# Altium schematic sheet MR26_GSS_7.SchDoc
size 386 x 296 mm; Origin: Eagle; OriginPath: C:\Users\David Nguyen\Downloads\eagle\eagle\MR26_GSS.sch; OriginSheet: 8; OriginDescription: 09 Interfaces: vehicle, CAN, USB-C, debug
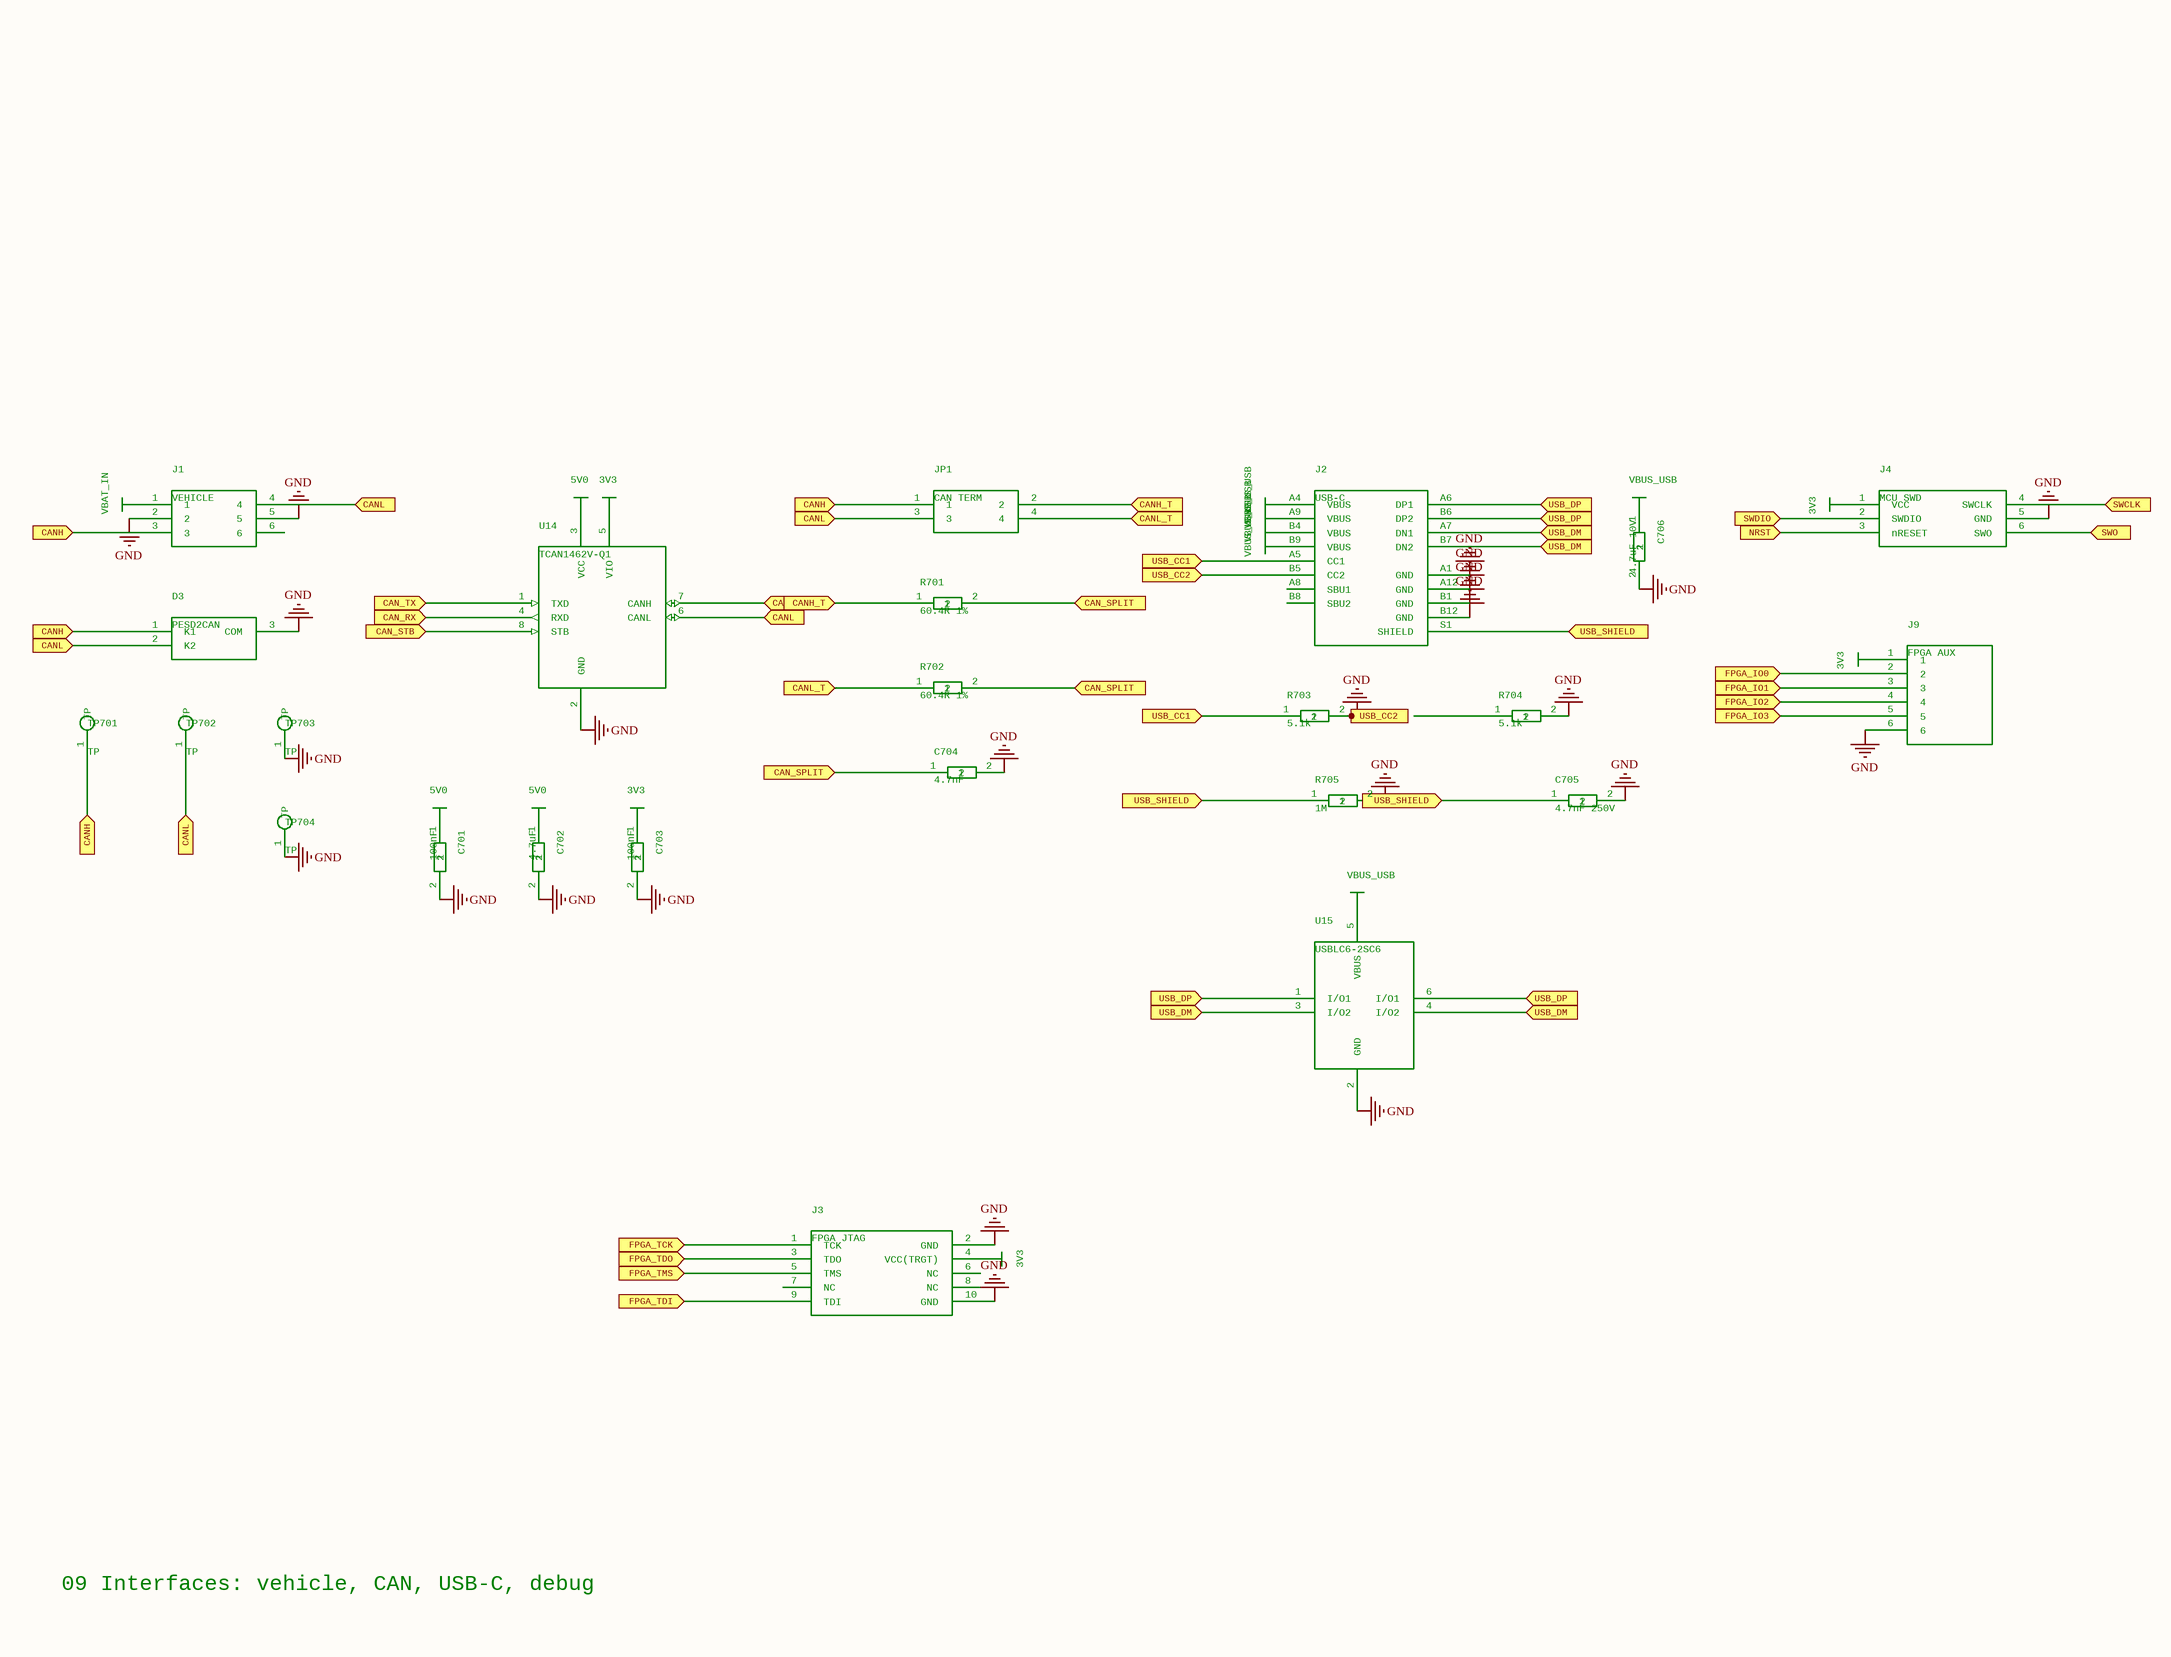
[diagram p0: MR26_GSS_7.SchDoc]

## Parts
C701  100nF  [C_0402]
C702  4.7uF  [C_0603]
C703  100nF  [C_0402]
C704  4.7nF  [C_0603]
C705  4.7nF 250V  [C_1206]
C706  4.7uF 10V  [C_0603]
D3  PESD2CAN  [SOT-23]
J1  VEHICLE  [Molex_Micro-Fit_43045-0600_2x3_RA]
J2  USB-C  [USB_C_GCT_USB4105]
J3  FPGA JTAG  [IDC-Header_2x05_P2.54mm]
J4  MCU SWD  [TC2030-IDC-NL]
J9  FPGA AUX  [PinHeader_1x06_P2.54mm]
JP1  CAN TERM  [PinHeader_2x02_P2.54mm]
PWR0571  VBAT_IN
PWR0577  5V0
PWR0578  3V3
PWR0580  5V0
PWR0582  5V0
PWR0584  3V3
PWR0587  VBUS_USB
PWR0588  VBUS_USB
PWR0589  VBUS_USB
PWR0590  VBUS_USB
PWR0599  VBUS_USB
PWR0601  VBUS_USB
PWR0604  3V3
PWR0606  3V3
PWR0608  3V3
R701  60.4R 1%  [R_0805]
R702  60.4R 1%  [R_0805]
R703  5.1k  [R_0402]
R704  5.1k  [R_0402]
R705  1M  [R_0402]
TP701  TP  [TP_1.0mm]
TP702  TP  [TP_1.0mm]
TP703  TP  [TP_1.0mm]
TP704  TP  [TP_1.0mm]
U14  TCAN1462V-Q1  [SOIC-8]
U15  USBLC6-2SC6  [SOT-23-6]

## Ports
CAN_RX (in), CAN_SPLIT (in), CAN_STB (in), CAN_TX (in), CANH (in), CANH_T (in), CANL (in), CANL_T (in), FPGA_IO0 (in), FPGA_IO1 (in), FPGA_IO2 (in), FPGA_IO3 (in), FPGA_TCK (in), FPGA_TDI (in), FPGA_TDO (in), FPGA_TMS (in), NRST (in), SWCLK (in), SWDIO (in), SWO (in), USB_CC1 (in), USB_CC2 (in), USB_DM (in), USB_DP (in), USB_SHIELD (in)

## Nets
GND: C701.2 C702.2 C703.2 C704.2 C705.2 C706.2 D3.3(COM) J1.2 J1.5 J2.A1(GND) J2.A12(GND) J2.B1(GND) J2.B5(CC2) J2.B12(GND) J3.2(GND) J3.10(GND) J4.5(GND) J9.6 R703.2 R704.2 R705.2 TP703.1(TP) TP704.1(TP) U14.2(GND) U15.2(GND) ; port USB_CC2
CAN_RX: U14.4(RXD) ; port CAN_RX
CAN_SPLIT: C704.1 R701.2 R702.2 ; port CAN_SPLIT
CAN_STB: U14.8(STB) ; port CAN_STB
CAN_TX: U14.1(TXD) ; port CAN_TX
CANH: D3.1(K1) J1.3 JP1.1 TP701.1(TP) U14.7(CANH) ; port CANH
CANH_T: JP1.2 R701.1 ; port CANH_T
CANL: D3.2(K2) J1.4 JP1.3 TP702.1(TP) U14.6(CANL) ; port CANL
CANL_T: JP1.4 R702.1 ; port CANL_T
FPGA_IO0: J9.2 ; port FPGA_IO0
FPGA_IO1: J9.3 ; port FPGA_IO1
FPGA_IO2: J9.4 ; port FPGA_IO2
FPGA_IO3: J9.5 ; port FPGA_IO3
FPGA_TCK: J3.1(TCK) ; port FPGA_TCK
FPGA_TDI: J3.9(TDI) ; port FPGA_TDI
FPGA_TDO: J3.3(TDO) ; port FPGA_TDO
FPGA_TMS: J3.5(TMS) ; port FPGA_TMS
NRST: J4.3(nRESET) ; port NRST
SWCLK: J4.4(SWCLK) ; port SWCLK
SWDIO: J4.2(SWDIO) ; port SWDIO
SWO: J4.6(SWO) ; port SWO
USB_CC1: J2.A5(CC1) R703.1 ; port USB_CC1
USB_DM: J2.A7(DN1) J2.B7(DN2) U15.3(I/O2) U15.4(I/O2) ; port USB_DM
USB_DP: J2.A6(DP1) J2.B6(DP2) U15.1(I/O1) U15.6(I/O1) ; port USB_DP
USB_SHIELD: C705.1 J2.S1(SHIELD) R705.1 ; port USB_SHIELD
NetC701_1: C701.1 PWR0580.?1(5V0)
NetC702_1: C702.1 PWR0582.?1(5V0)
NetC703_1: C703.1 PWR0584.?1(3V3)
NetC706_1: C706.1 PWR0599.?1(VBUS_USB)
NetJ1_1: J1.1 PWR0571.?1(VBAT_IN)
NetJ2_A4: J2.A4(VBUS) PWR0587.?1(VBUS_USB)
NetJ2_A9: J2.A9(VBUS) PWR0588.?1(VBUS_USB)
NetJ2_B4: J2.B4(VBUS) PWR0589.?1(VBUS_USB)
NetJ2_B9: J2.B9(VBUS) PWR0590.?1(VBUS_USB)
NetJ3_4: J3.4(VCC(TRGT)) PWR0604.?1(3V3)
NetJ4_1: J4.1(VCC) PWR0606.?1(3V3)
NetJ9_1: J9.1 PWR0608.?1(3V3)
NetPWR0577_?1: PWR0577.?1(5V0) U14.3(VCC)
NetPWR0578_?1: PWR0578.?1(3V3) U14.5(VIO)
NetPWR0601_?1: PWR0601.?1(VBUS_USB) U15.5(VBUS)

Not connected (* = marked no-connect by the designer): J1 6; J2 A8(SBU1) B8(SBU2); J3 6(NC) 7(NC) 8(NC); R704 1

## Notes on the sheet
- 09 Interfaces: vehicle, CAN, USB-C, debug

## Library data of the parts
C701 C703 = CAPC_0402: MPN: CAP 100nF 0402; GateName_1: G$1; SymbolName_1: CAP; DeviceName: C_0402; LibraryName: MR26; DeviceSetName: CAP
C702 = CAPC_0603: MPN: CAP 4.7uF 0603; GateName_1: G$1; SymbolName_1: CAP; DeviceName: C_0603; LibraryName: MR26; DeviceSetName: CAP
C704 = CAPC_0603: MPN: CAP 4.7nF 0603; GateName_1: G$1; SymbolName_1: CAP; DeviceName: C_0603; LibraryName: MR26; DeviceSetName: CAP
C705 = CAPC_1206: MPN: CAP 4.7nF 250V 1206; GateName_1: G$1; SymbolName_1: CAP; DeviceName: C_1206; LibraryName: MR26; DeviceSetName: CAP
C706 = CAPC_0603: MPN: CAP 4.7uF 10V 0603; GateName_1: G$1; SymbolName_1: CAP; DeviceName: C_0603; LibraryName: MR26; DeviceSetName: CAP
D3 = PESD2CAN_SOT23SOT-23: MPN: PESD2CAN,215; GateName_1: G$1; SymbolName_1: PESD2CAN_SOT23; DeviceName: SOT-23; LibraryName: MR26; DeviceSetName: PESD2CAN_SOT23
J1 = MICROFIT_2X3Molex_Micro-Fit_43045-0600_2x3_RA: MPN: Molex 43045-0600; GateName_1: G$1; SymbolName_1: MICROFIT_2X3; DeviceName: Molex_Micro-Fit_43045-0600_2x3_RA; LibraryName: MR26; DeviceSetName: MICROFIT_2X3
J2 = USB4105_USBCUSB_C_GCT_USB4105: MPN: GCT USB4105-GF-A; GateName_1: G$1; SymbolName_1: USB4105_USBC; DeviceName: USB_C_GCT_USB4105; LibraryName: MR26; DeviceSetName: USB4105_USBC
J3 = HDR_2X5_JTAGIDC-Header_2x05_P2.54mm: MPN: Wurth 61201021621; GateName_1: G$1; SymbolName_1: HDR_2X5_JTAG; DeviceName: IDC-Header_2x05_P2.54mm; LibraryName: MR26; DeviceSetName: HDR_2X5_JTAG
J4 = TC2030_IDC_NLTC2030-IDC-NL: MPN: Tag-Connect TC2030-IDC-NL (footprint only); GateName_1: G$1; SymbolName_1: TC2030_IDC_NL; DeviceName: TC2030-IDC-NL; LibraryName: MR26; DeviceSetName: TC2030_IDC_NL
J9 = HDR_1X6PinHeader_1x06_P2.54mm: MPN: Wurth 61300611121; GateName_1: G$1; SymbolName_1: HDR_1X6; DeviceName: PinHeader_1x06_P2.54mm; LibraryName: MR26; DeviceSetName: HDR_1X6
JP1 = HDR_2X2PinHeader_2x02_P2.54mm: MPN: Wurth 61300421121 + 2 shunts; GateName_1: G$1; SymbolName_1: HDR_2X2; DeviceName: PinHeader_2x02_P2.54mm; LibraryName: MR26; DeviceSetName: HDR_2X2
PWR0571 = PWR_VBAT_IN: GateName_1: G$1; SymbolName_1: PWR_VBAT_IN; LibraryName: MR26; DeviceSetName: PWR_VBAT_IN
PWR0577 PWR0580 PWR0582 = PWR_5V0: GateName_1: G$1; SymbolName_1: PWR_5V0; LibraryName: MR26; DeviceSetName: PWR_5V0
PWR0578 PWR0584 PWR0604 PWR0606 PWR0608 = PWR_3V3: GateName_1: G$1; SymbolName_1: PWR_3V3; LibraryName: MR26; DeviceSetName: PWR_3V3
PWR0587 PWR0588 PWR0589 PWR0590 PWR0599 PWR0601 = PWR_VBUS_USB: GateName_1: G$1; SymbolName_1: PWR_VBUS_USB; LibraryName: MR26; DeviceSetName: PWR_VBUS_USB
R701 R702 = RESR_0805: MPN: RES 60.4R 1% 0805; GateName_1: G$1; SymbolName_1: RES; DeviceName: R_0805; LibraryName: MR26; DeviceSetName: RES
R703 R704 = RESR_0402: MPN: RES 5.1k 0402; GateName_1: G$1; SymbolName_1: RES; DeviceName: R_0402; LibraryName: MR26; DeviceSetName: RES
R705 = RESR_0402: MPN: RES 1M 0402; GateName_1: G$1; SymbolName_1: RES; DeviceName: R_0402; LibraryName: MR26; DeviceSetName: RES
TP701-TP704 = TESTPOINTTP_1.0mm: MPN: Keystone 5019 / 1.0 mm pad; GateName_1: G$1; SymbolName_1: TESTPOINT; DeviceName: TP_1.0mm; LibraryName: MR26; DeviceSetName: TESTPOINT
U14 = TCAN1462V_SOIC8SOIC-8: MPN: TCAN1462VDRQ1; GateName_1: G$1; SymbolName_1: TCAN1462V_SOIC8; DeviceName: SOIC-8; LibraryName: MR26; DeviceSetName: TCAN1462V_SOIC8
U15 = USBLC6-2SC6SOT-23-6: GateName_1: G$1; SymbolName_1: USBLC6-2SC6; DeviceName: SOT-23-6; LibraryName: MR26; DeviceSetName: USBLC6-2SC6; MPN: USBLC6-2SC6